# EasyEDA schematic SCH_orbital_shaker_front_panel_v2_2022-09-11.json
TITLE: Sheet_1; REV: 1.0; Date: 2022-09-11; Sheet: 1/1; Drawn By: danielgigliotti99.dg; Company: Your Company
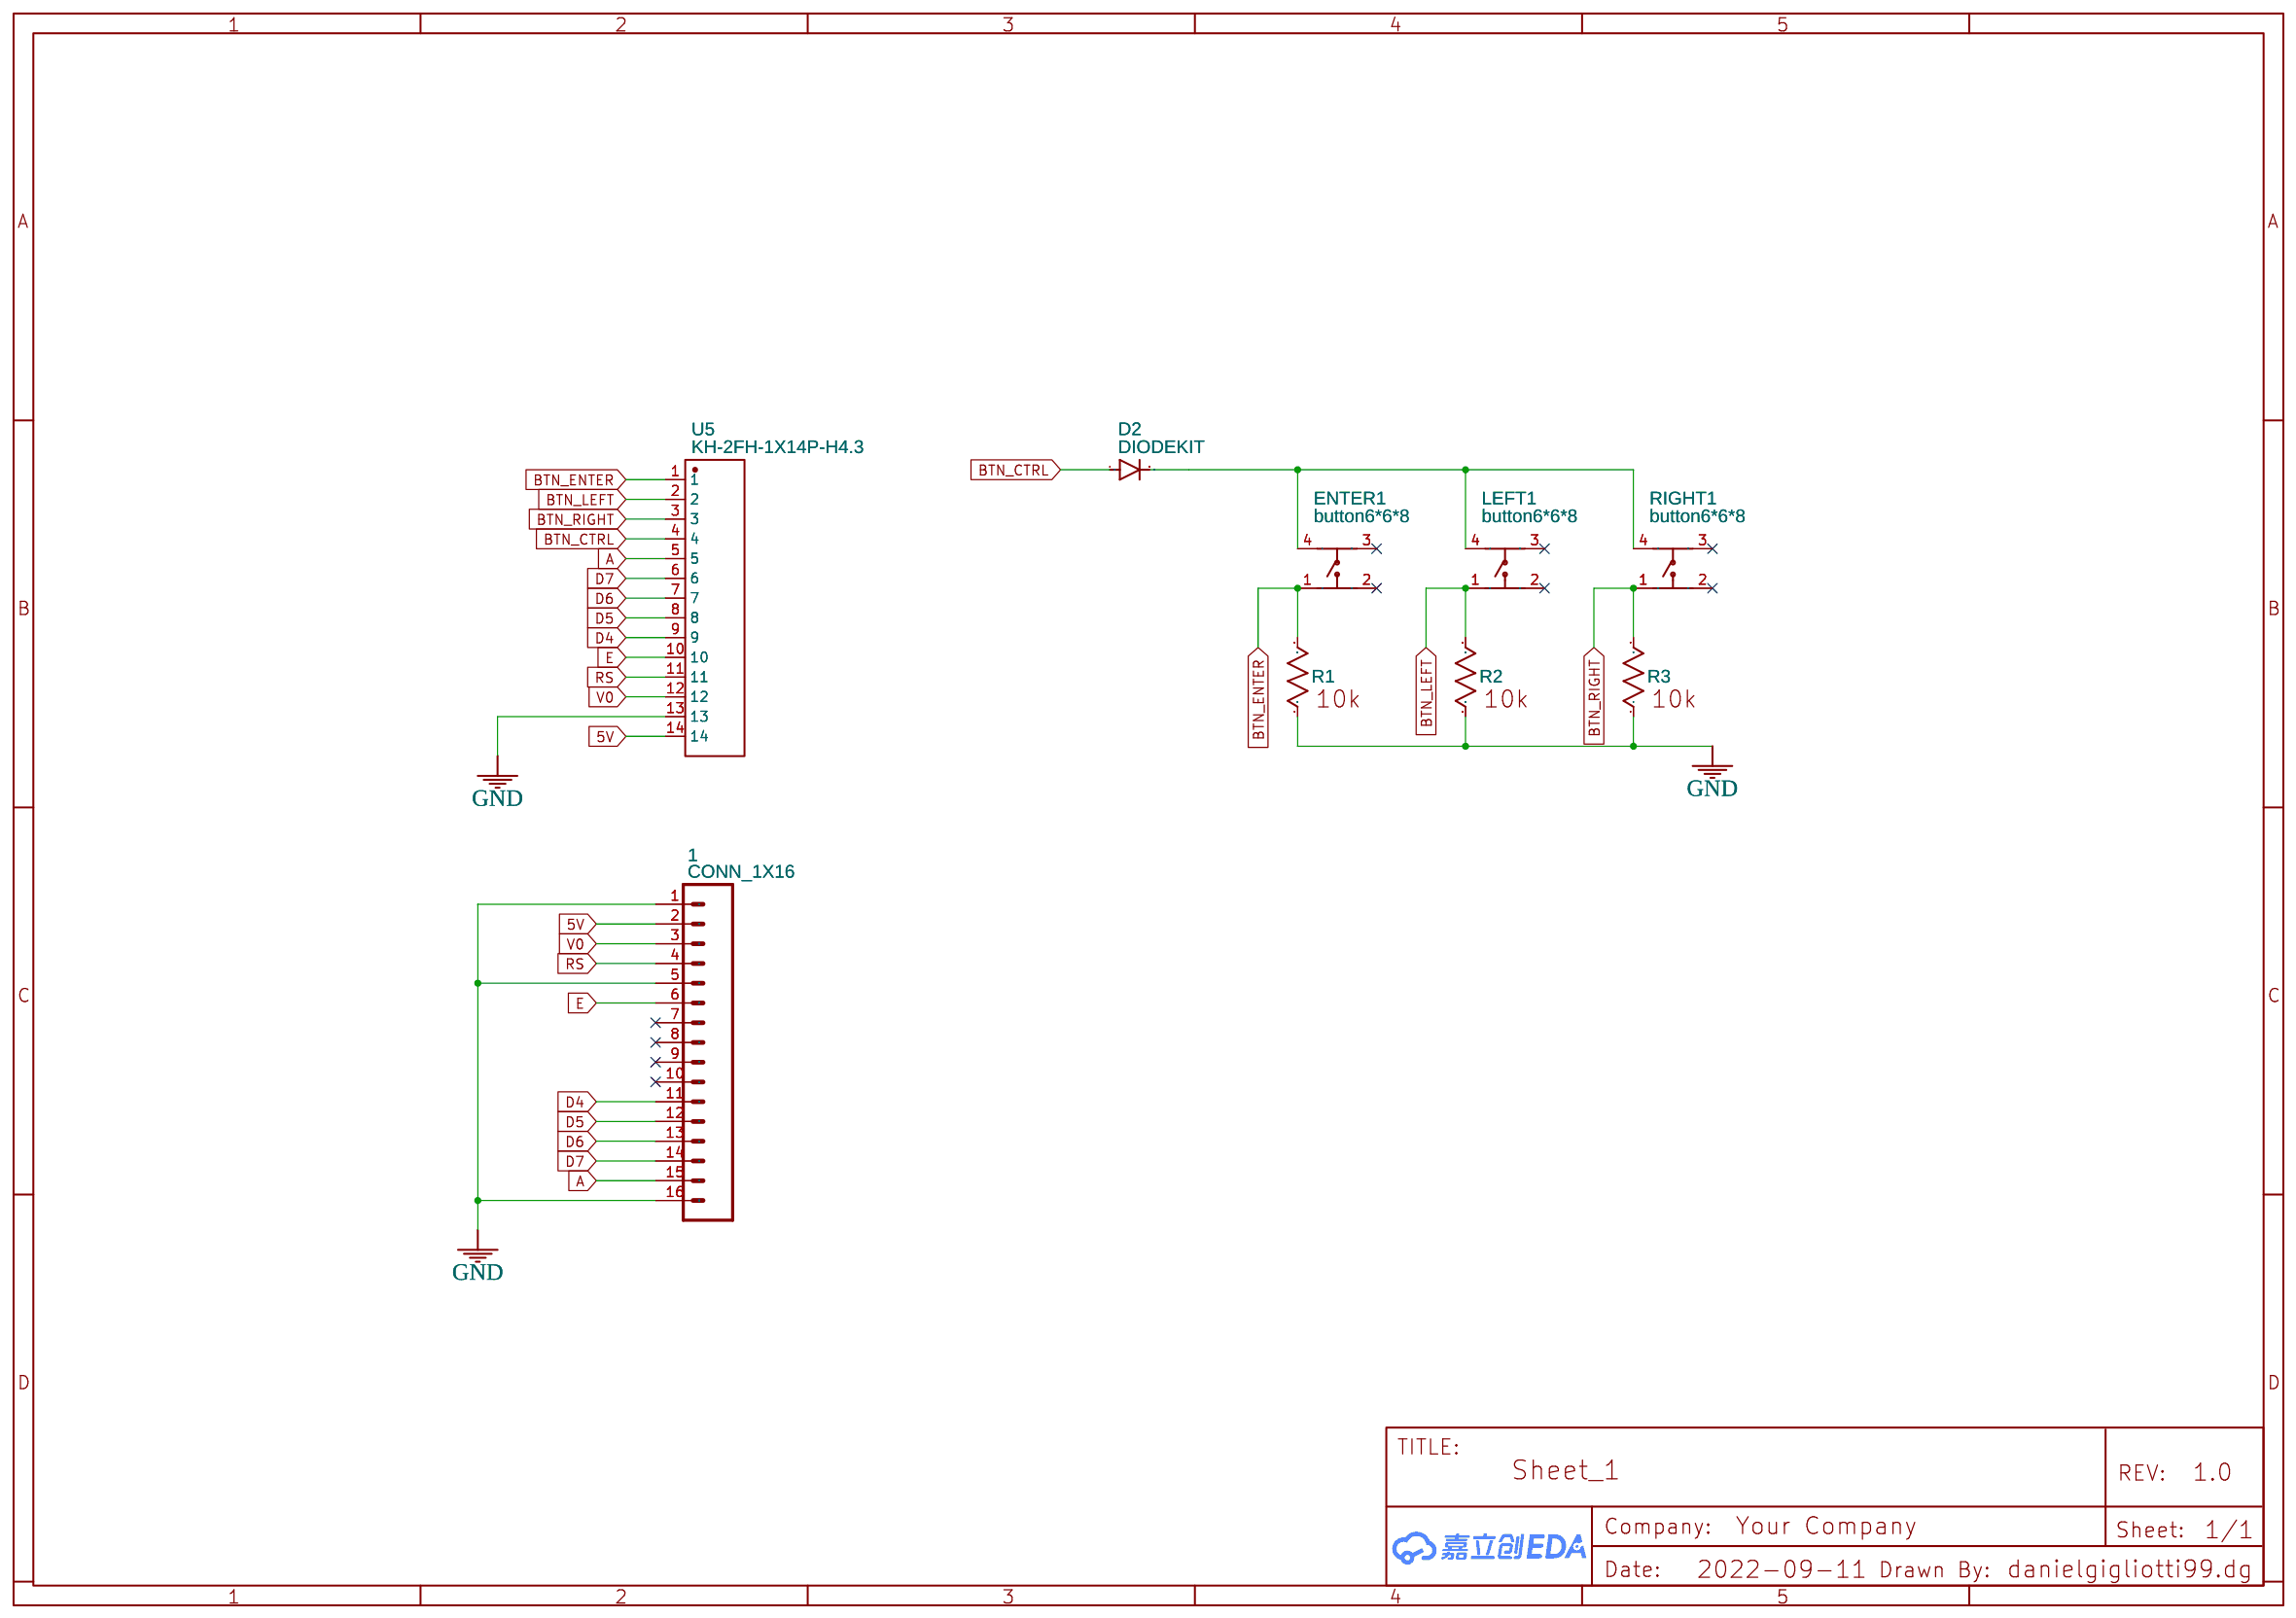
[diagram p0: schematic sheet]

## Parts
1  CONN_1X16  [1X16]
D2  DIODEKIT  [DIODE-1N4148-KIT]
ENTER1  button6*6*8  [KEY-TH_4P-L6.0-W6.0-P4.50-LS7.5]
LEFT1  button6*6*8  [KEY-TH_4P-L6.0-W6.0-P4.50-LS7.5]
R1  1k  [1K RESISTOR]
R2  1k  [1K RESISTOR]
R3  1k  [1K RESISTOR]
RIGHT1  button6*6*8  [KEY-TH_4P-L6.0-W6.0-P4.50-LS7.5]
U5  KH-2FH-1X14P-H4.3  [CONN-TH_14P-P2.00_KINGHELM_KH-2FH-1X14P-H4.3]

## Library data of the parts
1 = CONN_1X16: Contributor: ggchat
D2 = DIODEKIT: Contributor: gzeiler
ENTER1 LEFT1 RIGHT1 = button6*6*8: Supplier Part: C59982; Supplier: LCSC; Manufacturer: ReliaPro; JLCPCB Part Class: Extended Part
R1-R3 = 1K Resistor: Contributor: zackstry
U5 = KH-2FH-1X14P-H4.3: Supplier: LCSC; Supplier Part: C2938436; Manufacturer: kinghelm(金航标); Contributor: LCSC

## Nets
5V: 1.2 U5.14
GND: 1.1 1.5 1.16 R1.1 R2.1 R3.1 U5.13
V0: 1.3 U5.12
A: 1.15 U5.5
BTN_CTRL: D2.A U5.4
BTN_ENTER: ENTER1.1 R1.2 U5.1
BTN_LEFT: LEFT1.1 R2.2 U5.2
BTN_RIGHT: R3.2 RIGHT1.1 U5.3
D4: 1.11 U5.9
D5: 1.12 U5.8
D6: 1.13 U5.7
D7: 1.14 U5.6
E: 1.6 U5.10
RS: 1.4 U5.11
Net-(D2-C): D2.C ENTER1.4 LEFT1.4 RIGHT1.4

Not connected (* = marked no-connect by the designer): 1 7* 8* 9* 10*; ENTER1 2* 3*; LEFT1 2* 3*; RIGHT1 2* 3*
